# Altium project PROC154E3_SCH.PrjPcb (part 3 of 60)

## Sheet 12. SOC EMIF0 & LPDDR4.SchDoc: LPDDR4 INTERFACE - 1
size 513 x 386 mm; Project: PROC154E2(001)_SK_AM69; Issue: 1.0; RevCode: E3; Page Create Date: March  8, 1995; Variant Name: Core Design; Schematic Page Number: 12; Page Number: 12; Page Size: C; Comment: MISTRAL_TITLEBLK_CSIZE_1; Page Count: 62; Schematic Page Count: 62; Name: PROC154E2 001 SK AM69; DsnPath: C:\Users\danie\Downloads\sprr466c\PROC154E3_RP\PROC154E3_SCH.DSN; SchematicName: SCHEMATIC1; PageName: 12. SOC EMIF0 & LPDDR4; PageSize: C; TopSchematic: True
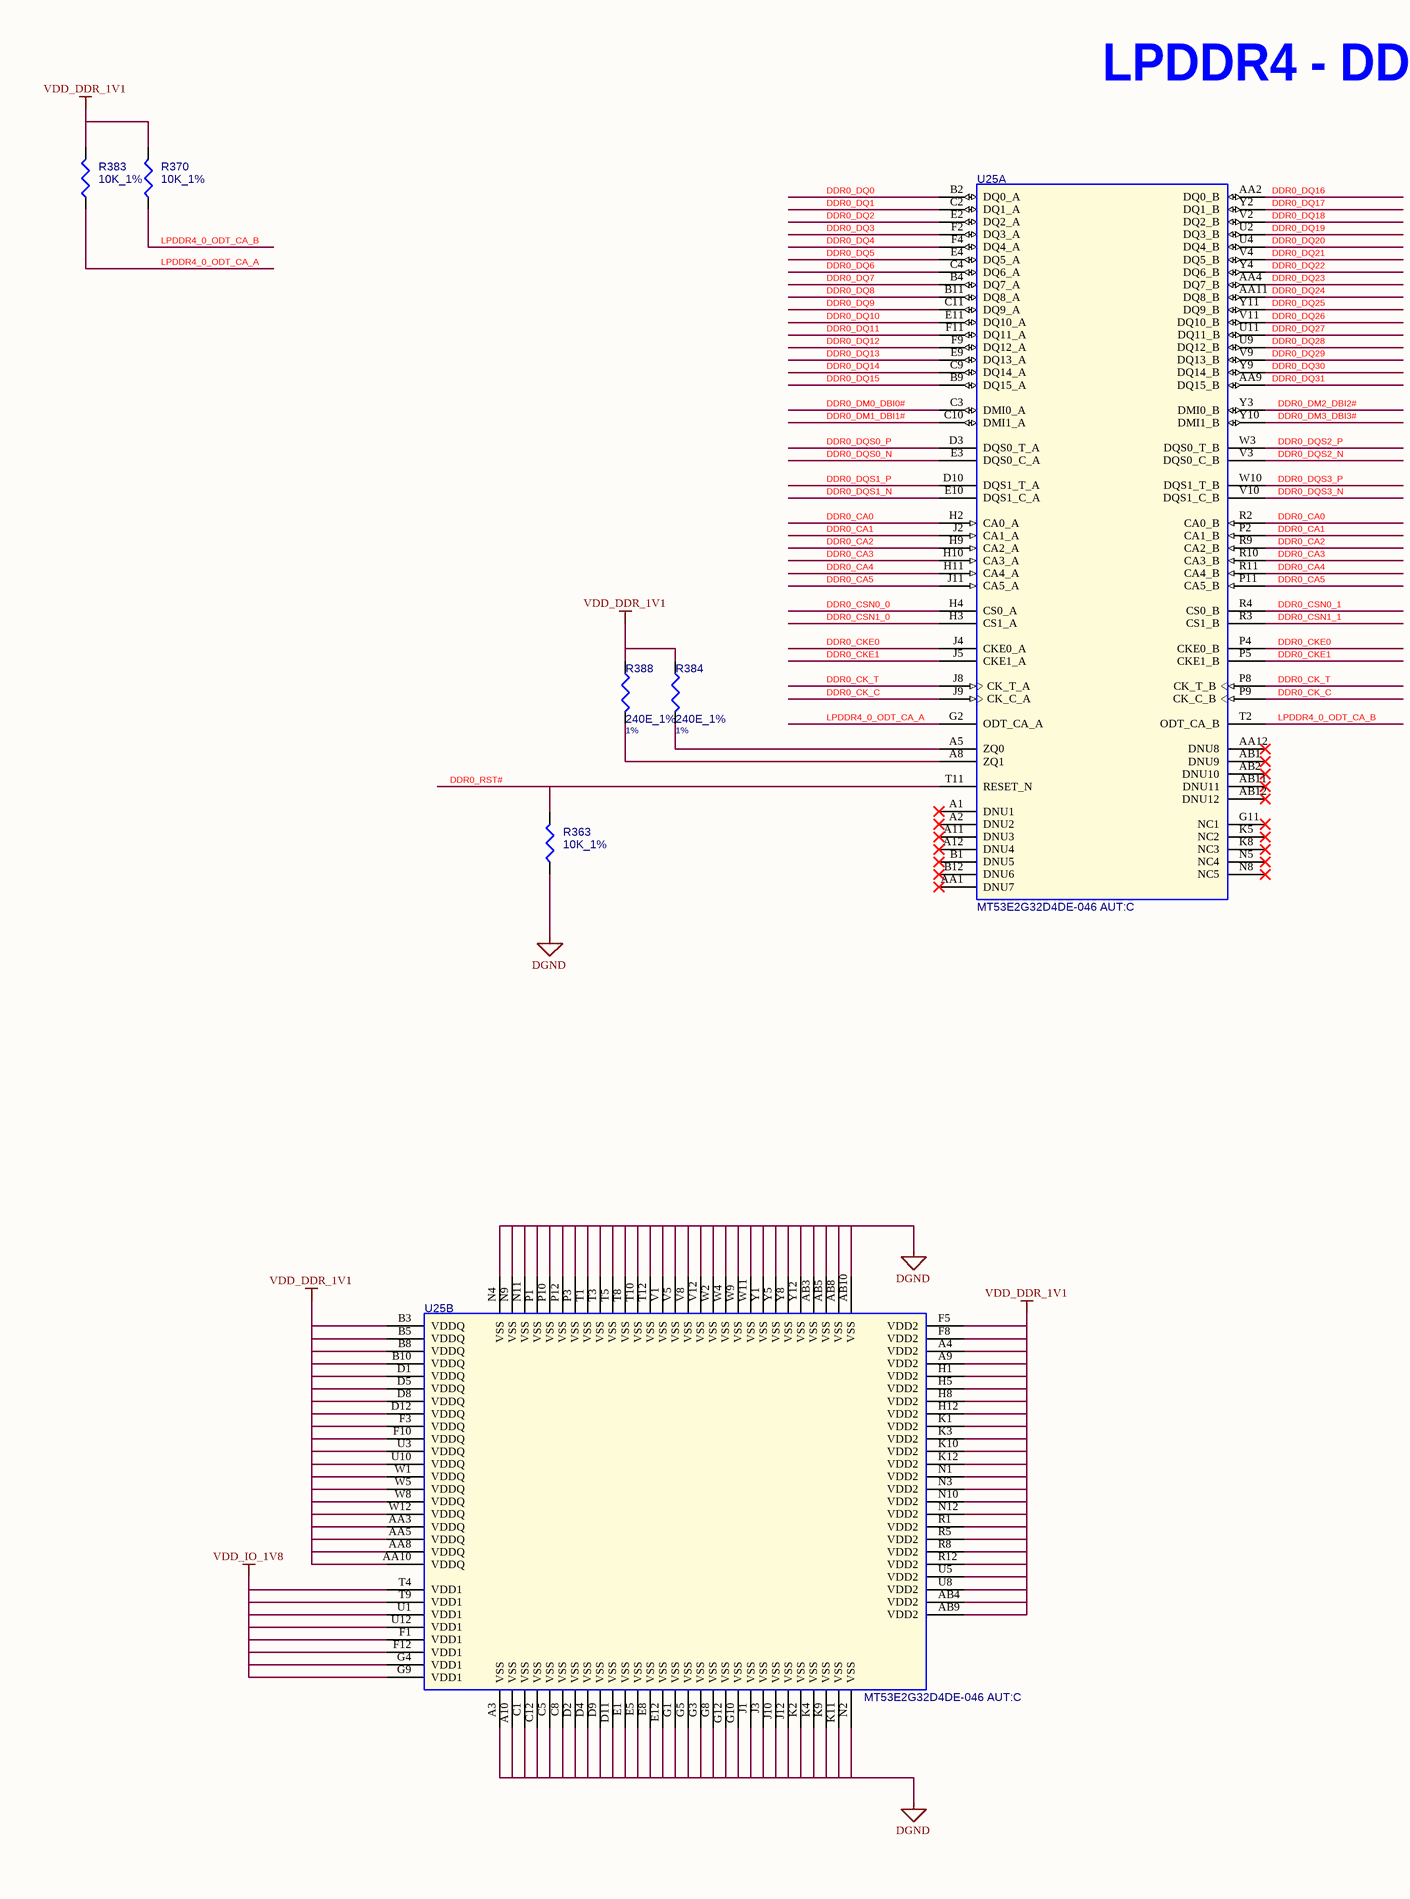
[diagram p14: 12. SOC EMIF0 & LPDDR4.SchDoc, left]
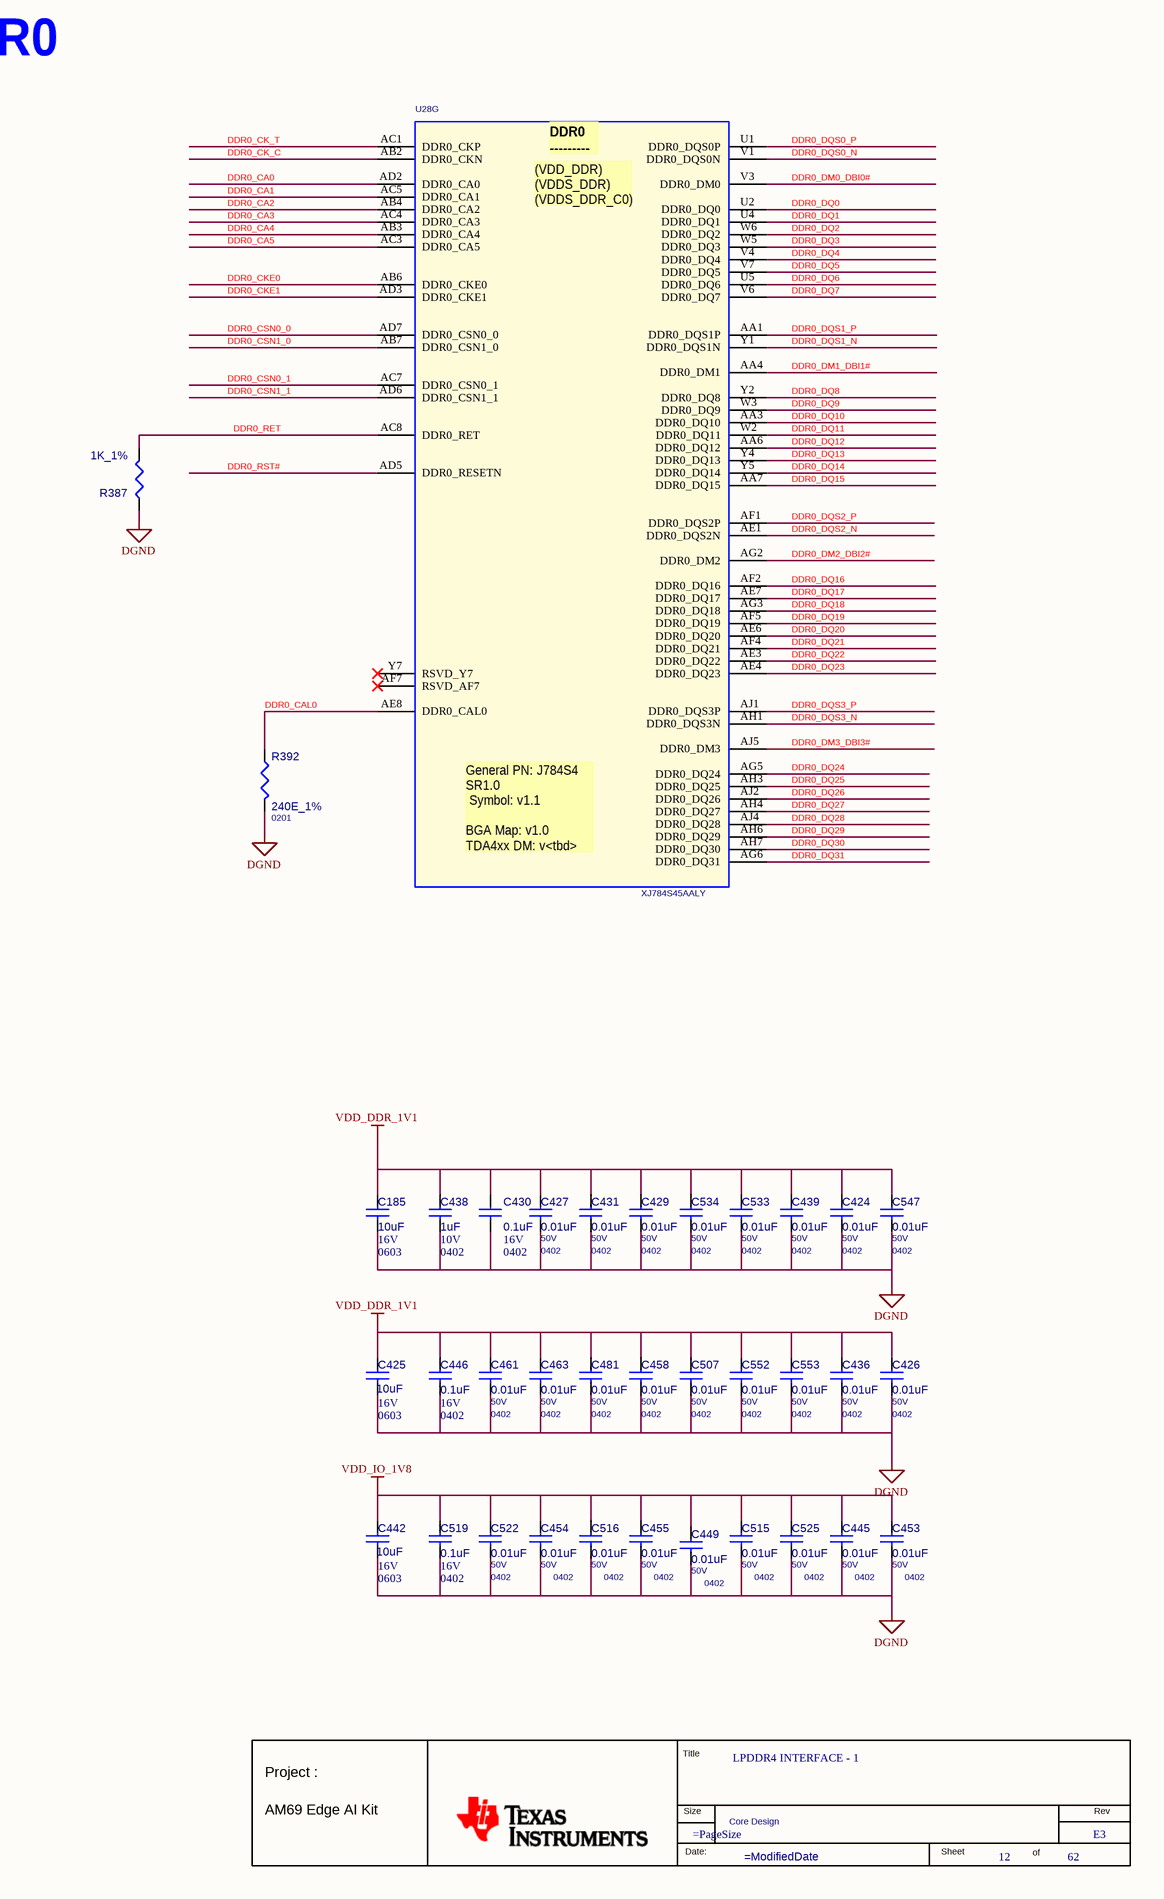
[diagram p15: 12. SOC EMIF0 & LPDDR4.SchDoc, right]

### Parts
(Parts that share a designator on the sheet are numbered #1, #2 ... from top to bottom, then left to right.)
*#12  RevCode: E3  Title: LPDDR4 INTERFACE - 1  Page Number: 12  Page Count: 62  Variant Name: Core Design  (hidden comment: MISTRAL_TITLEBLK_CSIZE_1)  (graphical)
C185  10uF  Package: 0603  Voltage: 16V  [CAP0603_1]
C424  0.01uF  Package: 0402  Voltage: 50V  [CAP0402_0-75]
C425  10uF  Voltage: 16V  Package: 0603  [CAP0603_1]
C426  0.01uF  Package: 0402  Voltage: 50V  [CAP0402_0-75]
C427  0.01uF  Voltage: 50V  Package: 0402  [CAP0402_0-75]
C429  0.01uF  Package: 0402  Voltage: 50V  [CAP0402_0-75]
C430  0.1uF  Package: 0402  Voltage: 16V  [CAP0402_0-75]
C431  0.01uF  Package: 0402  Voltage: 50V  [CAP0402_0-75]
C436  0.01uF  Voltage: 50V  Package: 0402  [CAP0402_0-75]
C438  1uF  Package: 0402  Voltage: 10V  [CAP0402_0-75]
C439  0.01uF  Package: 0402  Voltage: 50V  [CAP0402_0-75]
C442  10uF  Voltage: 16V  Package: 0603  [CAP0603_1]
C445  0.01uF  Package: 0402  Voltage: 50V  [CAP0402_0-75]
C446  0.1uF  Package: 0402  Voltage: 16V  [CAP0402_0-75]
C449  0.01uF  Voltage: 50V  Package: 0402  [CAP0402_0-75]
C453  0.01uF  Voltage: 50V  Package: 0402  [CAP0402_0-75]
C454  0.01uF  Package: 0402  Voltage: 50V  [CAP0402_0-75]
C455  0.01uF  Package: 0402  Voltage: 50V  [CAP0402_0-75]
C458  0.01uF  Package: 0402  Voltage: 50V  [CAP0402_0-75]
C461  0.01uF  Package: 0402  Voltage: 50V  [CAP0402_0-75]
C463  0.01uF  Package: 0402  Voltage: 50V  [CAP0402_0-75]
C481  0.01uF  Package: 0402  Voltage: 50V  [CAP0402_0-75]
C507  0.01uF  Voltage: 50V  Package: 0402  [CAP0402_0-75]
C515  0.01uF  Package: 0402  Voltage: 50V  [CAP0402_0-75]
C516  0.01uF  Package: 0402  Voltage: 50V  [CAP0402_0-75]
C519  0.1uF  Voltage: 16V  Package: 0402  [CAP0402_0-75]
C522  0.01uF  Voltage: 50V  Package: 0402  [CAP0402_0-75]
C525  0.01uF  Voltage: 50V  Package: 0402  [CAP0402_0-75]
C533  0.01uF  Package: 0402  Voltage: 50V  [CAP0402_0-75]
C534  0.01uF  Package: 0402  Voltage: 50V  [CAP0402_0-75]
C547  0.01uF  Voltage: 50V  Package: 0402  [CAP0402_0-75]
C552  0.01uF  Voltage: 50V  Package: 0402  [CAP0402_0-75]
C553  0.01uF  Package: 0402  Voltage: 50V  [CAP0402_0-75]
R363  10K_1%  [RES0402_0-5]
R370  10K_1%  [RES0402_0-5]
R383  10K_1%  [RES0402_0-5]
R384  240E_1%  Tolerance: 1%  [RES0201_0-5]
R387  1K_1%  [RES0402_0-5]
R388  240E_1%  Tolerance: 1%  [RES0201_0-5]
R392  240E_1%  Package: 0201  [RES0201_0-5]
U25  MT53E2G32D4DE-046 AUT:C  [WFBGA200_MT53DDS_400X570_1-2]  (parts A,B of 2)
U28  XJ784S45AALY  [BGA1414_31-49_1230X1230_2-7]  (part G of 26)

### Nets
DGND: C185.2 C424.2 C425.2 C426.2 C427.2 C429.2 C430.2 C431.2 C436.2 C438.2 C439.2 C442.2 C445.2 C446.2 C449.2 C453.2 C454.2 C455.2 C458.2 C461.2 C463.2 C481.2 C507.2 C515.2 C516.2 C519.2 C522.2 C525.2 C533.2 C534.2 C547.2 C552.2 C553.2 R363.1 R387.2 R392.2 U25.A3(VSS) U25.A10(VSS) U25.AB3(VSS) U25.AB5(VSS) U25.AB8(VSS) U25.AB10(VSS) U25.C1(VSS) U25.C5(VSS) U25.C8(VSS) U25.C12(VSS) U25.D2(VSS) U25.D4(VSS) U25.D9(VSS) U25.D11(VSS) U25.E1(VSS) U25.E5(VSS) U25.E8(VSS) U25.E12(VSS) U25.G1(VSS) U25.G3(VSS) U25.G5(VSS) U25.G8(VSS) U25.G10(VSS) U25.G12(VSS) U25.J1(VSS) U25.J3(VSS) U25.J10(VSS) U25.J12(VSS) U25.K2(VSS) U25.K4(VSS) U25.K9(VSS) U25.K11(VSS) U25.N2(VSS) U25.N4(VSS) U25.N9(VSS) U25.N11(VSS) U25.P1(VSS) U25.P3(VSS) U25.P10(VSS) U25.P12(VSS) U25.T1(VSS) U25.T3(VSS) U25.T5(VSS) U25.T8(VSS) U25.T10(VSS) U25.T12(VSS) U25.V1(VSS) U25.V5(VSS) U25.V8(VSS) U25.V12(VSS) U25.W2(VSS) U25.W4(VSS) U25.W9(VSS) U25.W11(VSS) U25.Y1(VSS) U25.Y5(VSS) U25.Y8(VSS) U25.Y12(VSS)  [project net VDD_CPU_HCPS_GOSNS]
VDD_DDR_1V1: C185.1 C424.1 C425.1 C426.1 C427.1 C429.1 C430.1 C431.1 C436.1 C438.1 C439.1 C446.1 C458.1 C461.1 C463.1 C481.1 C507.1 C533.1 C534.1 C547.1 C552.1 C553.1 R370.2 R383.2 R384.1 R388.1 U25.A4(VDD2) U25.A9(VDD2) U25.AA3(VDDQ) U25.AA5(VDDQ) U25.AA8(VDDQ) U25.AA10(VDDQ) U25.AB4(VDD2) U25.AB9(VDD2) U25.B3(VDDQ) U25.B5(VDDQ) U25.B8(VDDQ) U25.B10(VDDQ) U25.D1(VDDQ) U25.D5(VDDQ) U25.D8(VDDQ) U25.D12(VDDQ) U25.F3(VDDQ) U25.F5(VDD2) U25.F8(VDD2) U25.F10(VDDQ) U25.H1(VDD2) U25.H5(VDD2) U25.H8(VDD2) U25.H12(VDD2) U25.K1(VDD2) U25.K3(VDD2) U25.K10(VDD2) U25.K12(VDD2) U25.N1(VDD2) U25.N3(VDD2) U25.N10(VDD2) U25.N12(VDD2) U25.R1(VDD2) U25.R5(VDD2) U25.R8(VDD2) U25.R12(VDD2) U25.U3(VDDQ) U25.U5(VDD2) U25.U8(VDD2) U25.U10(VDDQ) U25.W1(VDDQ) U25.W5(VDDQ) U25.W8(VDDQ) U25.W12(VDDQ)
VDD_IO_1V8: C442.1 C445.1 C449.1 C453.1 C454.1 C455.1 C515.1 C516.1 C519.1 C522.1 C525.1 U25.F1(VDD1) U25.F12(VDD1) U25.G4(VDD1) U25.G9(VDD1) U25.T4(VDD1) U25.T9(VDD1) U25.U1(VDD1) U25.U12(VDD1)
DDR0_CA0: U25.H2(CA0_A) U25.R2(CA0_B) U28.AD2(DDR0_CA0)
DDR0_CA1: U25.J2(CA1_A) U25.P2(CA1_B) U28.AC5(DDR0_CA1)
DDR0_CA2: U25.H9(CA2_A) U25.R9(CA2_B) U28.AB4(DDR0_CA2)
DDR0_CA3: U25.H10(CA3_A) U25.R10(CA3_B) U28.AC4(DDR0_CA3)
DDR0_CA4: U25.H11(CA4_A) U25.R11(CA4_B) U28.AB3(DDR0_CA4)
DDR0_CA5: U25.J11(CA5_A) U25.P11(CA5_B) U28.AC3(DDR0_CA5)
DDR0_CAL0: R392.1 U28.AE8(DDR0_CAL0)
DDR0_CK_C: U25.J9(CK_C_A) U25.P9(CK_C_B) U28.AB2(DDR0_CKN)
DDR0_CK_T: U25.J8(CK_T_A) U25.P8(CK_T_B) U28.AC1(DDR0_CKP)
DDR0_CKE0: U25.J4(CKE0_A) U25.P4(CKE0_B) U28.AB6(DDR0_CKE0)
DDR0_CKE1: U25.J5(CKE1_A) U25.P5(CKE1_B) U28.AD3(DDR0_CKE1)
DDR0_CSN0_0: U25.H4(CS0_A) U28.AD7(DDR0_CSN0_0)
DDR0_CSN0_1: U25.R4(CS0_B) U28.AC7(DDR0_CSN0_1)
DDR0_CSN1_0: U25.H3(CS1_A) U28.AB7(DDR0_CSN1_0)
DDR0_CSN1_1: U25.R3(CS1_B) U28.AD6(DDR0_CSN1_1)
DDR0_DM0_DBI0#: U25.C3(DMI0_A) U28.V3(DDR0_DM0)
DDR0_DM1_DBI1#: U25.C10(DMI1_A) U28.AA4(DDR0_DM1)
DDR0_DM2_DBI2#: U25.Y3(DMI0_B) U28.AG2(DDR0_DM2)
DDR0_DM3_DBI3#: U25.Y10(DMI1_B) U28.AJ5(DDR0_DM3)
DDR0_DQ0: U25.B2(DQ0_A) U28.U2(DDR0_DQ0)
DDR0_DQ1: U25.C2(DQ1_A) U28.U4(DDR0_DQ1)
DDR0_DQ2: U25.E2(DQ2_A) U28.W6(DDR0_DQ2)
DDR0_DQ3: U25.F2(DQ3_A) U28.W5(DDR0_DQ3)
DDR0_DQ4: U25.F4(DQ4_A) U28.V4(DDR0_DQ4)
DDR0_DQ5: U25.E4(DQ5_A) U28.V7(DDR0_DQ5)
DDR0_DQ6: U25.C4(DQ6_A) U28.U5(DDR0_DQ6)
DDR0_DQ7: U25.B4(DQ7_A) U28.V6(DDR0_DQ7)
DDR0_DQ8: U25.B11(DQ8_A) U28.Y2(DDR0_DQ8)
DDR0_DQ9: U25.C11(DQ9_A) U28.W3(DDR0_DQ9)
DDR0_DQ10: U25.E11(DQ10_A) U28.AA3(DDR0_DQ10)
DDR0_DQ11: U25.F11(DQ11_A) U28.W2(DDR0_DQ11)
DDR0_DQ12: U25.F9(DQ12_A) U28.AA6(DDR0_DQ12)
DDR0_DQ13: U25.E9(DQ13_A) U28.Y4(DDR0_DQ13)
DDR0_DQ14: U25.C9(DQ14_A) U28.Y5(DDR0_DQ14)
DDR0_DQ15: U25.B9(DQ15_A) U28.AA7(DDR0_DQ15)
DDR0_DQ16: U25.AA2(DQ0_B) U28.AF2(DDR0_DQ16)
DDR0_DQ17: U25.Y2(DQ1_B) U28.AE7(DDR0_DQ17)
DDR0_DQ18: U25.V2(DQ2_B) U28.AG3(DDR0_DQ18)
DDR0_DQ19: U25.U2(DQ3_B) U28.AF5(DDR0_DQ19)
DDR0_DQ20: U25.U4(DQ4_B) U28.AE6(DDR0_DQ20)
DDR0_DQ21: U25.V4(DQ5_B) U28.AF4(DDR0_DQ21)
DDR0_DQ22: U25.Y4(DQ6_B) U28.AE3(DDR0_DQ22)
DDR0_DQ23: U25.AA4(DQ7_B) U28.AE4(DDR0_DQ23)
DDR0_DQ24: U25.AA11(DQ8_B) U28.AG5(DDR0_DQ24)
DDR0_DQ25: U25.Y11(DQ9_B) U28.AH3(DDR0_DQ25)
DDR0_DQ26: U25.V11(DQ10_B) U28.AJ2(DDR0_DQ26)
DDR0_DQ27: U25.U11(DQ11_B) U28.AH4(DDR0_DQ27)
DDR0_DQ28: U25.U9(DQ12_B) U28.AJ4(DDR0_DQ28)
DDR0_DQ29: U25.V9(DQ13_B) U28.AH6(DDR0_DQ29)
DDR0_DQ30: U25.Y9(DQ14_B) U28.AH7(DDR0_DQ30)
DDR0_DQ31: U25.AA9(DQ15_B) U28.AG6(DDR0_DQ31)
DDR0_DQS0_N: U25.E3(DQS0_C_A) U28.V1(DDR0_DQS0N)
DDR0_DQS0_P: U25.D3(DQS0_T_A) U28.U1(DDR0_DQS0P)
DDR0_DQS1_N: U25.E10(DQS1_C_A) U28.Y1(DDR0_DQS1N)
DDR0_DQS1_P: U25.D10(DQS1_T_A) U28.AA1(DDR0_DQS1P)
DDR0_DQS2_N: U25.V3(DQS0_C_B) U28.AE1(DDR0_DQS2N)
DDR0_DQS2_P: U25.W3(DQS0_T_B) U28.AF1(DDR0_DQS2P)
DDR0_DQS3_N: U25.V10(DQS1_C_B) U28.AH1(DDR0_DQS3N)
DDR0_DQS3_P: U25.W10(DQS1_T_B) U28.AJ1(DDR0_DQS3P)
DDR0_RET: R387.1 U28.AC8(DDR0_RET)
DDR0_RST#: R363.2 U25.T11(RESET_N) U28.AD5(DDR0_RESETN)
LPDDR4_0_ODT_CA_A: R383.1 U25.G2(ODT_CA_A)
LPDDR4_0_ODT_CA_B: R370.1 U25.T2(ODT_CA_B)
NetR384_2: R384.2 U25.A5(ZQ0)
NetR388_2: R388.2 U25.A8(ZQ1)

Not connected (* = marked no-connect by the designer): U25 A1(DNU1)* A2(DNU2)* A11(DNU3)* A12(DNU4)* AA1(DNU7)* AA12(DNU8)* AB1(DNU9)* AB2(DNU10)* AB11(DNU11)* AB12(DNU12)* B1(DNU5)* B12(DNU6)* G11(NC1)* K5(NC2)* K8(NC3)* N5(NC4)* N8(NC5)*; U28 AF7(RSVD_AF7)* Y7(RSVD_Y7)*

### Notes on the sheet
- LPDDR4 - DDR0
- (in symbol J7AHPSoC-EVM_BGA1414, part G) DDR0 / ---------; (VDD_DDR) / (VDDS_DDR) / (VDDS_DDR_C0); General PN: J784S4 / SR1.0 / Symbol: v1.1 / BGA Map: v1.0 / TDA4xx DM: v<tbd>
- (in symbol MISTRAL_TITLEBLK_CSIZE_1) Title; Project :; Size; Rev; AM69 Edge AI Kit; Date:; Sheet; of